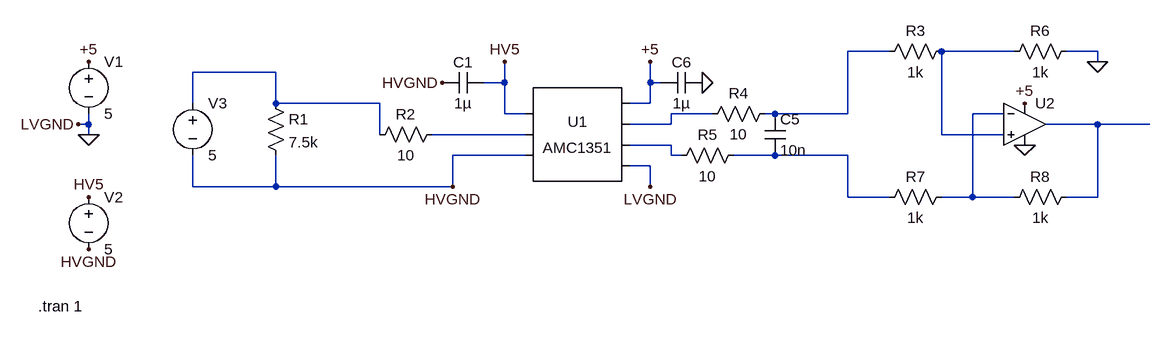
[diagram p0: schematic AMC1351Test.asc]
AMC1351Test.asc, the LTspice schematic file:
Version 4
SHEET 1 1092 680
WIRE 688 48 624 48
WIRE 880 48 768 48
WIRE 1008 48 960 48
WIRE 1008 64 1008 48
WIRE -256 80 -384 80
WIRE 96 96 96 64
WIRE 96 96 64 96
WIRE 320 96 320 64
WIRE 336 96 320 96
WIRE -384 128 -384 80
WIRE -256 128 -256 80
WIRE -96 128 -256 128
WIRE 320 128 320 96
WIRE 320 128 288 128
WIRE 96 144 96 96
WIRE 128 144 96 144
WIRE 416 144 352 144
WIRE 512 144 496 144
WIRE 624 144 624 48
WIRE 624 144 512 144
WIRE 864 144 816 144
WIRE -544 160 -544 144
WIRE -544 160 -560 160
WIRE 352 160 352 144
WIRE 352 160 288 160
WIRE 1008 160 928 160
WIRE 1088 160 1008 160
WIRE -544 176 -544 160
WIRE -96 176 -96 128
WIRE 128 176 -16 176
WIRE 768 176 768 48
WIRE 864 176 768 176
WIRE 352 192 288 192
WIRE 128 208 16 208
WIRE 352 208 352 192
WIRE 368 208 352 208
WIRE 512 208 448 208
WIRE 624 208 512 208
WIRE 320 224 288 224
WIRE -384 256 -384 208
WIRE -256 256 -256 208
WIRE -256 256 -384 256
WIRE 16 256 16 208
WIRE 16 256 -256 256
WIRE 320 256 320 224
WIRE 624 272 624 208
WIRE 688 272 624 272
WIRE 816 272 816 144
WIRE 816 272 768 272
WIRE 880 272 816 272
WIRE 1008 272 1008 160
WIRE 1008 272 960 272
FLAG 320 64 +5
FLAG 96 64 HV5
FLAG 320 256 LVGND
FLAG 16 256 HVGND
FLAG -544 176 0
FLAG -560 160 LVGND
FLAG -544 352 HVGND
FLAG -544 272 HV5
FLAG -544 64 +5
FLAG 400 96 0
FLAG 0 96 HVGND
FLAG 1008 64 0
FLAG 896 192 0
FLAG 896 128 +5
SYMBOL cap 64 80 R90
WINDOW 0 0 32 VBottom 2
WINDOW 3 32 32 VTop 2
SYMATTR InstName C1
SYMATTR Value 1µ
SYMBOL res -272 112 R0
SYMATTR InstName R1
SYMATTR Value 7.5k
SYMBOL cap 496 144 R0
SYMATTR InstName C5
SYMATTR Value 10n
SYMBOL res 464 192 R90
WINDOW 0 0 56 VBottom 2
WINDOW 3 32 56 VTop 2
SYMATTR InstName R5
SYMATTR Value 10
SYMBOL res 512 128 R90
WINDOW 0 0 56 VBottom 2
WINDOW 3 32 56 VTop 2
SYMATTR InstName R4
SYMATTR Value 10
SYMBOL cap 400 80 R90
WINDOW 0 0 32 VBottom 2
WINDOW 3 32 32 VTop 2
SYMATTR InstName C6
SYMATTR Value 1µ
SYMBOL voltage -544 48 R0
WINDOW 123 24 114 Left 2
WINDOW 39 0 0 Left 0
SYMATTR InstName V1
SYMATTR Value 5
SYMBOL voltage -544 256 R0
WINDOW 123 24 114 Left 2
WINDOW 39 0 0 Left 0
SYMATTR InstName V2
SYMATTR Value 5
SYMBOL voltage -384 112 R0
WINDOW 123 0 0 Left 0
WINDOW 39 0 0 Left 0
SYMATTR InstName V3
SYMATTR Value 5
SYMBOL AutoGenerated\\AMC1351 208 176 R0
SYMATTR InstName U1
SYMBOL res 0 160 R90
WINDOW 0 0 56 VBottom 2
WINDOW 3 32 56 VTop 2
SYMATTR InstName R2
SYMATTR Value 10
SYMBOL OpAmps\\UniversalOpamp2 896 160 R0
SYMATTR InstName U2
SYMBOL res 784 32 R90
WINDOW 0 0 56 VBottom 2
WINDOW 3 32 56 VTop 2
SYMATTR InstName R3
SYMATTR Value 1k
SYMBOL res 976 32 R90
WINDOW 0 0 56 VBottom 2
WINDOW 3 32 56 VTop 2
SYMATTR InstName R6
SYMATTR Value 1k
SYMBOL res 784 256 R90
WINDOW 0 0 56 VBottom 2
WINDOW 3 32 56 VTop 2
SYMATTR InstName R7
SYMATTR Value 1k
SYMBOL res 976 256 R90
WINDOW 0 0 56 VBottom 2
WINDOW 3 32 56 VTop 2
SYMATTR InstName R8
SYMATTR Value 1k
TEXT -622 440 Left 2 !.tran 1

The netlist it stands for:
* AMC1351Test.asc
C1 HV5 HVGND 1µ
R1 N003 HVGND 7.5k
C5 N001 N009 10n
R5 N009 N008 10
R4 N001 N004 10
C6 0 +5 1µ
V1 +5 0 5
V2 HV5 HVGND 5
V3 N003 HVGND 5
* U1: AMC1351 (symbol AutoGenerated\AMC1351 not available, pins judged from their places): pin1=HV5 pin2=N007 pin3=HVGND pin4=+5 pin5=N004 pin6=N008 pin7=0
R2 N007 N003 10
XU2 N002 N005 +5 0 N006 level.2 Avol=1Meg GBW=10Meg Slew=10Meg ilimit=25m rail=0 Vos=0 phimargin=45 en=0 enk=0 in=0 ink=0 Rin=500Meg  ; pins IN+ IN- V+ V- OUT
R3 N002 N001 1k
R6 0 N002 1k
R7 N005 N009 1k
R8 N006 N005 1k
.tran 1
.lib UniversalOpamps2.sub
.backanno
.end